# Altium schematic sheet RMP_LED_MODULE.SchDoc
size Letter; SheetNumber: 2; SheetTotal: 7
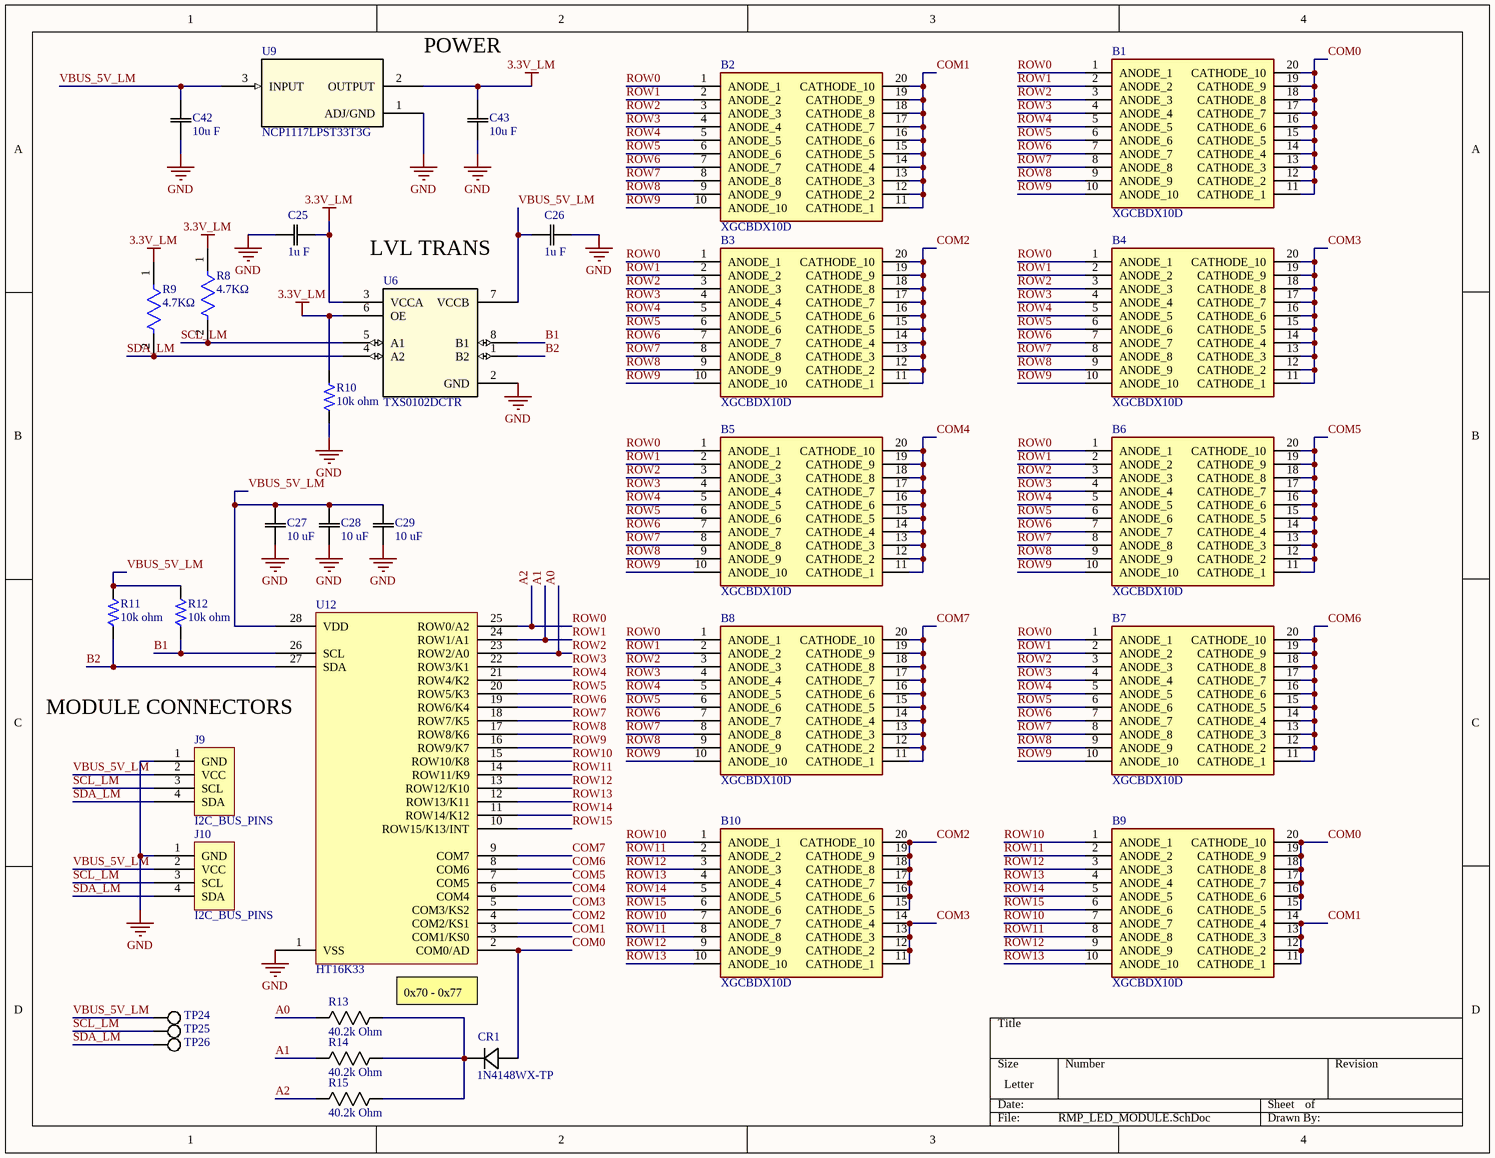
[diagram p0: RMP_LED_MODULE.SchDoc]

## Parts
B1  XGCBDX10D  [DIPS750W75P254L2540H825Q20N]
B2  XGCBDX10D  [DIPS750W75P254L2540H825Q20N]
B3  XGCBDX10D  [DIPS750W75P254L2540H825Q20N]
B4  XGCBDX10D  [DIPS750W75P254L2540H825Q20N]
B5  XGCBDX10D  [DIPS750W75P254L2540H825Q20N]
B6  XGCBDX10D  [DIPS750W75P254L2540H825Q20N]
B7  XGCBDX10D  [DIPS750W75P254L2540H825Q20N]
B8  XGCBDX10D  [DIPS750W75P254L2540H825Q20N]
B9  XGCBDX10D  [DIPS750W75P254L2540H825Q20N]
B10  XGCBDX10D  [DIPS750W75P254L2540H825Q20N]
C25  value 1u F  [CAP_CL21B105KAFNNNE_SAM-M]  (hidden comment: CL21B105KAFNNNE)
C26  value 1u F  [CAP_CL21B105KAFNNNE_SAM-M]  (hidden comment: CL21B105KAFNNNE)
C27  value 10 uF  [CAP_CL21_SAM-M]  (hidden comment: CL21A106KOQNNNE)
C28  value 10 uF  [CAP_CL21_SAM-M]  (hidden comment: CL21A106KOQNNNE)
C29  value 10 uF  [CAP_CL21_SAM-M]  (hidden comment: CL21A106KOQNNNE)
C42  value 10u F  [G-21_MUR-M]  (hidden comment: GRM21BR61C106KE15K)
C43  value 10u F  [G-21_MUR-M]  (hidden comment: GRM21BR61C106KE15K)
CR1  1N4148WX-TP  [CR_SOD323_MCC-M]
J9  I2C_BUS_PINS  [4 PIN HEADER]
J10  I2C_BUS_PINS  [4 PIN HEADER]
R8  Resistance: 4.7KΩ  [FP-RT0805-MFG]  (hidden comment: RT0805FRE134K7L)
R9  Resistance: 4.7KΩ  [FP-RT0805-MFG]  (hidden comment: RT0805FRE134K7L)
R10  value 10k ohm  [STA_RNCP0805_STP-M]  (hidden comment: RNCP0805FTD10K0)
R11  value 10k ohm  [STA_RNCP0805_STP-M]  (hidden comment: RNCP0805FTD10K0)
R12  value 10k ohm  [STA_RNCP0805_STP-M]  (hidden comment: RNCP0805FTD10K0)
R13  value 40.2k Ohm  [STA_RNCP0805_STP-M - duplicate]  (hidden comment: RNCP0805FTD40K2)
R14  value 40.2k Ohm  [STA_RNCP0805_STP-M - duplicate]  (hidden comment: RNCP0805FTD40K2)
R15  value 40.2k Ohm  [STA_RNCP0805_STP-M - duplicate]  (hidden comment: RNCP0805FTD40K2)
TP24  TestPoint  [Testpoint]  (value not drawn)
TP25  TestPoint  [Testpoint]  (value not drawn)
TP26  TestPoint  [Testpoint]  (value not drawn)
U6  TXS0102DCTR  [DCT8]
U9  NCP1117LPST33T3G  [SOT223-3_ONS-M]
U12  HT16K33  [SOP-28-300mil]

## Nets
3.3V_LM: C25.1 C43.2 R8.1 R9.1 R10.1 U6.3(VCCA) U6.6(OE) U9.2(OUTPUT)
GND: C25.2 C26.1 C27.1 C28.1 C29.1 C42.1 C43.1 J9.1(GND) J10.1(GND) R10.2 U6.2(GND) U9.1(ADJ/GND) U12.1(VSS)
A0: B1.3(ANODE_3) B2.3(ANODE_3) B3.3(ANODE_3) B4.3(ANODE_3) B5.3(ANODE_3) B6.3(ANODE_3) B7.3(ANODE_3) B8.3(ANODE_3) R13.2 U12.23(ROW2/A0)  [also labelled ROW2]
A1: B1.2(ANODE_2) B2.2(ANODE_2) B3.2(ANODE_2) B4.2(ANODE_2) B5.2(ANODE_2) B6.2(ANODE_2) B7.2(ANODE_2) B8.2(ANODE_2) R14.2 U12.24(ROW1/A1)  [also labelled ROW1]
A2: B1.1(ANODE_1) B2.1(ANODE_1) B3.1(ANODE_1) B4.1(ANODE_1) B5.1(ANODE_1) B6.1(ANODE_1) B7.1(ANODE_1) B8.1(ANODE_1) R15.2 U12.25(ROW0/A2)  [also labelled ROW0]
B1: R12.1 U6.8(B1) U12.26(SCL)
B2: R11.1 U6.1(B2) U12.27(SDA)
COM0: B1.11(CATHODE_1) B1.12(CATHODE_2) B1.13(CATHODE_3) B1.14(CATHODE_4) B1.15(CATHODE_5) B1.16(CATHODE_6) B1.17(CATHODE_7) B1.18(CATHODE_8) B1.19(CATHODE_9) B1.20(CATHODE_10) B9.15(CATHODE_5) B9.16(CATHODE_6) B9.17(CATHODE_7) B9.18(CATHODE_8) B9.19(CATHODE_9) B9.20(CATHODE_10) CR1.2 U12.2(COM0/AD)
COM1: B2.11(CATHODE_1) B2.12(CATHODE_2) B2.13(CATHODE_3) B2.14(CATHODE_4) B2.15(CATHODE_5) B2.16(CATHODE_6) B2.17(CATHODE_7) B2.18(CATHODE_8) B2.19(CATHODE_9) B2.20(CATHODE_10) B9.11(CATHODE_1) B9.12(CATHODE_2) B9.13(CATHODE_3) B9.14(CATHODE_4) U12.3(COM1/KS0)
COM2: B3.11(CATHODE_1) B3.12(CATHODE_2) B3.13(CATHODE_3) B3.14(CATHODE_4) B3.15(CATHODE_5) B3.16(CATHODE_6) B3.17(CATHODE_7) B3.18(CATHODE_8) B3.19(CATHODE_9) B3.20(CATHODE_10) B10.15(CATHODE_5) B10.16(CATHODE_6) B10.17(CATHODE_7) B10.18(CATHODE_8) B10.19(CATHODE_9) B10.20(CATHODE_10) U12.4(COM2/KS1)
COM3: B4.11(CATHODE_1) B4.12(CATHODE_2) B4.13(CATHODE_3) B4.14(CATHODE_4) B4.15(CATHODE_5) B4.16(CATHODE_6) B4.17(CATHODE_7) B4.18(CATHODE_8) B4.19(CATHODE_9) B4.20(CATHODE_10) B10.11(CATHODE_1) B10.12(CATHODE_2) B10.13(CATHODE_3) B10.14(CATHODE_4) U12.5(COM3/KS2)
COM4: B5.11(CATHODE_1) B5.12(CATHODE_2) B5.13(CATHODE_3) B5.14(CATHODE_4) B5.15(CATHODE_5) B5.16(CATHODE_6) B5.17(CATHODE_7) B5.18(CATHODE_8) B5.19(CATHODE_9) B5.20(CATHODE_10) U12.6(COM4)
COM5: B6.11(CATHODE_1) B6.12(CATHODE_2) B6.13(CATHODE_3) B6.14(CATHODE_4) B6.15(CATHODE_5) B6.16(CATHODE_6) B6.17(CATHODE_7) B6.18(CATHODE_8) B6.19(CATHODE_9) B6.20(CATHODE_10) U12.7(COM5)
COM6: B7.11(CATHODE_1) B7.12(CATHODE_2) B7.13(CATHODE_3) B7.14(CATHODE_4) B7.15(CATHODE_5) B7.16(CATHODE_6) B7.17(CATHODE_7) B7.18(CATHODE_8) B7.19(CATHODE_9) B7.20(CATHODE_10) U12.8(COM6)
COM7: B8.11(CATHODE_1) B8.12(CATHODE_2) B8.13(CATHODE_3) B8.14(CATHODE_4) B8.15(CATHODE_5) B8.16(CATHODE_6) B8.17(CATHODE_7) B8.18(CATHODE_8) B8.19(CATHODE_9) B8.20(CATHODE_10) U12.9(COM7)
ROW3: B1.4(ANODE_4) B2.4(ANODE_4) B3.4(ANODE_4) B4.4(ANODE_4) B5.4(ANODE_4) B6.4(ANODE_4) B7.4(ANODE_4) B8.4(ANODE_4) U12.22(ROW3/K1)
ROW4: B1.5(ANODE_5) B2.5(ANODE_5) B3.5(ANODE_5) B4.5(ANODE_5) B5.5(ANODE_5) B6.5(ANODE_5) B7.5(ANODE_5) B8.5(ANODE_5) U12.21(ROW4/K2)
ROW5: B1.6(ANODE_6) B2.6(ANODE_6) B3.6(ANODE_6) B4.6(ANODE_6) B5.6(ANODE_6) B6.6(ANODE_6) B7.6(ANODE_6) B8.6(ANODE_6) U12.20(ROW5/K3)
ROW6: B1.7(ANODE_7) B2.7(ANODE_7) B3.7(ANODE_7) B4.7(ANODE_7) B5.7(ANODE_7) B6.7(ANODE_7) B7.7(ANODE_7) B8.7(ANODE_7) U12.19(ROW6/K4)
ROW7: B1.8(ANODE_8) B2.8(ANODE_8) B3.8(ANODE_8) B4.8(ANODE_8) B5.8(ANODE_8) B6.8(ANODE_8) B7.8(ANODE_8) B8.8(ANODE_8) U12.18(ROW7/K5)
ROW8: B1.9(ANODE_9) B2.9(ANODE_9) B3.9(ANODE_9) B4.9(ANODE_9) B5.9(ANODE_9) B6.9(ANODE_9) B7.9(ANODE_9) B8.9(ANODE_9) U12.17(ROW8/K6)
ROW9: B1.10(ANODE_10) B2.10(ANODE_10) B3.10(ANODE_10) B4.10(ANODE_10) B5.10(ANODE_10) B6.10(ANODE_10) B7.10(ANODE_10) B8.10(ANODE_10) U12.16(ROW9/K7)
ROW10: B9.1(ANODE_1) B9.7(ANODE_7) B10.1(ANODE_1) B10.7(ANODE_7) U12.15(ROW10/K8)
ROW11: B9.2(ANODE_2) B9.8(ANODE_8) B10.2(ANODE_2) B10.8(ANODE_8) U12.14(ROW11/K9)
ROW12: B9.3(ANODE_3) B9.9(ANODE_9) B10.3(ANODE_3) B10.9(ANODE_9) U12.13(ROW12/K10)
ROW13: B9.4(ANODE_4) B9.10(ANODE_10) B10.4(ANODE_4) B10.10(ANODE_10) U12.12(ROW13/K11)
ROW14: B9.5(ANODE_5) B10.5(ANODE_5) U12.11(ROW14/K12)
ROW15: B9.6(ANODE_6) B10.6(ANODE_6) U12.10(ROW15/K13/INT)
SCL_LM: J9.3(SCL) J10.3(SCL) R8.2 TP25.1 U6.5(A1)
SDA_LM: J9.4(SDA) J10.4(SDA) R9.2 TP26.1 U6.4(A2)
VBUS_5V_LM: C26.2 C27.2 C28.2 C29.2 C42.2 J9.2(VCC) J10.2(VCC) R11.2 R12.2 TP24.1 U6.7(VCCB) U9.3(INPUT) U12.28(VDD)
NetCR1_1: CR1.1 R13.1 R14.1 R15.1

## Notes on the sheet
- POWER
- (near U6) LVL TRANS
- (near J9) MODULE CONNECTORS
- 0x70 - 0x77

## Library data of the parts
B1-B10 = XGCBDX10D: BARGRAPH 10-SEGMENT BLUE; Manufacturer_Name: SunLED; Geometry.Height: 8.25mm; Manufacturer_Part_Number: XGCBDX10D; Mouser Part Number: *; Mouser Price/Stock: *; Arrow Part Number: *; Arrow Price/Stock: *; Datasheet Link: https://www.sunledusa.com/products/spec/XGCBDX10D.pdf
C25 C26 = CAP_CL21B105KAFNNNE: 1 µF ±10% 25V Ceramic Capacitor X7R 0805 (2012 Metric); Mfr_Name: Samsung
C27-C29 = CAP_CL21A106KOQNNNE: 10 µF ±10% 16V Ceramic Capacitor X5R 0805 (2012 Metric)
C42 C43 = CAP_GRM21BR61C106KE15K: 10 µF ±10% 16V Ceramic Capacitor X5R 0805 (2012 Metric); Mfr_Name: Murata
CR1 = 1N4148WX-TP: No Description Available; Mfr_Name: MCC
R8 R9 = CMP-03412-025396-1: RT0805 4.7KΩ 0.125W 50 ppm/°C 0.01%; Manufacturer: Yageo; Tolerance: 0.0001; Voltage Rating: 150V; Category: Res; Footprint Url: http://www.yageo.com/exep/pages/download/literatures/PYu-R_Mount_10.pdf; Package: RT0805; Composition: Thin Film; Device Class L3: Chip SMD Resistors; Ipc Land Pattern Name: RESC200125X50; Temperature Range Low: -55°C; Lead Free: Yes; Temperature Range High: +155°C; Temperature Coefficient: 50 ppm/°C; Octopart: https://octopart.com/rt0805fre134k7l-yageo-16262042; ComponentLink2URL: http://www.yageo.com/documents/recent/PYu-RT_1-to-0.01_RoHS_L_9.pdf; Device Class L1: Passive Components; Value: 4.7KΩ; Automotive: No; Height: 0.6mm; Device Class L2: Resistors; RoHS: TRUE; Manufacturer Part Number: RT0805FRE134K7L; Power Rating: 0.125W; Temperature: -55°C to +155°C; Series: RT; ComponentLink2Description: Datasheet
R10-R12 = RES_RNCP0805FTD10K0: 10 kOhms ±1% 0.25W, 1/4W Chip Resistor 0805 (2012 Metric) Anti-Sulfur Thin Film; Supplier 1: Digikey; Supplier Part Number 1: RNCP0805FTD10K0CT-ND
R13-R15 = RES_RNCP0805FTD40K2: 40.2 kOhms ±1% 0.25W, 1/4W Chip Resistor 0805 (2012 Metric) Anti-Sulfur Thin Film; Mfr_Name: Stackpole International
U6 = TXS0102DCTR: Voltage Level Translator Bidirectional 1 Circuit 2 Channel 24Mbps SM8; Mfr_Name: Texas Instruments; RefDes: RefDes; Type: Type
U9 = NCP1117LPST33T3G: Linear Voltage Regulator IC Positive Fixed 1 Output 1A SOT-223; Mfr_Name: onsemi; RefDes: RefDes; Type: Type
U12 = HT16K33: 16X8 LED MAtrix Driver